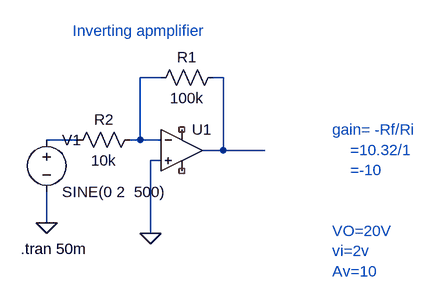
[diagram p0: schematic inverting amp.asc]
inverting amp.asc, the LTspice schematic file:
Version 4.1
SHEET 1 880 680
WIRE 240 0 208 0
WIRE 336 0 320 0
WIRE 112 96 64 96
WIRE 208 96 208 0
WIRE 208 96 192 96
WIRE 240 96 208 96
WIRE 336 112 336 0
WIRE 336 112 304 112
WIRE 400 112 336 112
WIRE 240 128 224 128
WIRE 64 224 64 176
WIRE 224 240 224 128
FLAG 224 240 0
FLAG 64 224 0
SYMBOL OpAmps\\UniversalOpAmp1 272 112 R0
SYMATTR InstName U1
SYMBOL res 336 -16 R90
WINDOW 0 0 56 VBottom 2
WINDOW 3 32 56 VTop 2
SYMATTR InstName R1
SYMATTR Value 100k
SYMBOL res 208 80 R90
WINDOW 0 0 56 VBottom 2
WINDOW 3 32 56 VTop 2
SYMATTR InstName R2
SYMATTR Value 10k
SYMBOL voltage 64 80 R0
WINDOW 123 0 0 Left 0
WINDOW 39 0 0 Left 0
SYMATTR InstName V1
SYMATTR Value SINE(0 2  500)
TEXT 24 264 Left 2 !.tran 50m
TEXT 504 80 Left 2 ;gain= -Rf/Ri\n    =10.32/1\n    =-10\n \n\nVO=20V\nvi=2v\nAv=10
TEXT 104 -72 Left 2 ;Inverting apmplifier

The netlist it stands for:
* inverting amp.asc
X§U1 0 N001 NC_01 NC_02 N002 level1 Avol=1Meg GBW=10Meg Vos=0 En=0 Enk=0 In=0 Ink=0 Rin=500Meg  ; pins In+ In- V+ V- OUT
R1 N002 N001 100k
R2 N001 N003 10k
V1 N003 0 SINE(0 2  500)
.tran 50m
* gain= -Rf/Ri
*     =10.32/1
*     =-10
* VO=20V
* vi=2v
* Av=10
* Inverting apmplifier
.lib UniversalOpAmp1.lib
.backanno
.end